# Altium schematic sheet FE1.1S.SchDoc
size A4
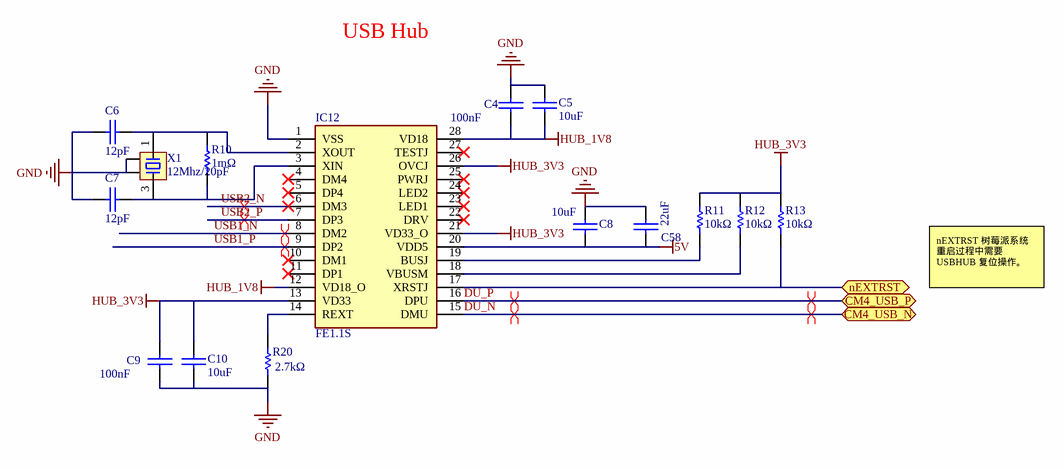
[diagram p0: FE1.1S.SchDoc]

## Parts
C4  100nF  [C_0402]
C5  10uF  [C_0603]
C6  12pF  [C_0402]
C7  12pF  [C_0402]
C8  10uF  [C_0603]
C9  100nF  [C_0402]
C10  10uF  [C_0603]
C58  22uF  [C_0805]
IC12  FE1.1S  [SOP64P600X175-28N]
R10  1mΩ  [R_0402]
R11  10kΩ  [R_0402]
R12  10kΩ  [R_0402]
R13  10kΩ  [R_0402]
R20  2.7kΩ  [R_0402]
X1  12Mhz/20pF  [XTAL_3225-4P]

## Ports
CM4_USB_N (bidir), CM4_USB_P (bidir), nEXTRST (bidir)

## Nets
5V: C8.2 C58.1 IC12.20(VDD5)
GND: C4.2 C5.1 C6.2 C7.1 C8.1 C9.1 C10.2 C58.2 IC12.1(VSS) R20.1 X1.2 X1.4
HUB_1V8: C4.1 C5.2 IC12.12(VD18_O) IC12.28(VD18)
HUB_3V3: C9.2 C10.1 IC12.13(VD33) IC12.21(VD33_O) IC12.26(OVCJ) R11.2 R12.2 R13.2
DU_N: IC12.15(DMU) ; port CM4_USB_N
DU_P: IC12.16(DPU) ; port CM4_USB_P
nEXTRST: IC12.17(XRSTJ) R13.1 ; port nEXTRST
USB1_N: IC12.8(DM2)
USB1_P: IC12.9(DP2)
USB2_N: IC12.6(DM3)
USB2_P: IC12.7(DP3)
NetC6_1: C6.1 IC12.2(XOUT) R10.2 X1.1
NetC7_2: C7.2 IC12.3(XIN) R10.1 X1.3
NetIC12_14: IC12.14(REXT) R20.2
NetIC12_18: IC12.18(VBUSM) R12.1
NetIC12_19: IC12.19(BUSJ) R11.1

Not connected (* = marked no-connect by the designer): IC12 4(DM4)* 5(DP4)* 10(DM1)* 11(DP1)* 22(DRV)* 23(LED1)* 24(LED2)* 25(PWRJ)* 27(TESTJ)*

## Layout directives
differential pair: DU_N, DU_P, USB1_N, USB1_P, USB2_N, USB2_P

## Notes on the sheet
- USB Hub
- nEXTRST 树莓派系统重启过程中需要USBHUB 复位操作。

## Library data of the parts
C4-C10 C58 = Cap_Chip: 贴片电容; Manufacturer_Name: *; Manufacturer_Part_Number: *
IC12 = FE1.1S: Integrated Circuit; Manufacturer_Name: JFD IC; Manufacturer_Part_Number: FE1.1S
R10-R13 R20 = Res_Chip: 贴片电阻; Manufacturer_Name: *; Manufacturer_Part_Number: *
X1 = Crystal_4P: 4脚无源晶振; Manufacturer_Name: *; Manufacturer_Part_Number: *